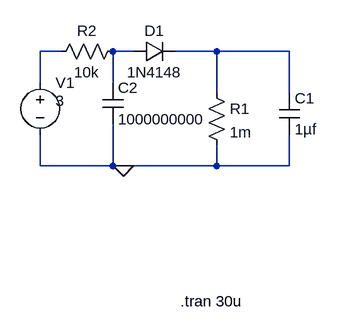
[diagram p0: schematic Draft3.asc]
Draft3.asc, the LTspice schematic file:
Version 4.1
SHEET 1 880 680
WIRE 64 64 32 64
WIRE 176 64 144 64
WIRE 304 64 240 64
WIRE 416 64 304 64
WIRE 32 112 32 64
WIRE 144 112 144 64
WIRE 304 128 304 64
WIRE 416 128 416 64
WIRE 32 240 32 192
WIRE 144 240 144 176
WIRE 144 240 32 240
WIRE 160 240 144 240
WIRE 304 240 304 208
WIRE 304 240 160 240
WIRE 416 240 416 192
WIRE 416 240 304 240
FLAG 160 240 0
SYMBOL voltage 32 96 R0
WINDOW 3 24 44 Left 2
WINDOW 123 0 0 Left 0
WINDOW 39 0 0 Left 0
SYMATTR InstName V1
SYMATTR Value 3
SYMBOL diode 176 80 R270
WINDOW 0 32 32 VTop 2
WINDOW 3 0 32 VBottom 2
SYMATTR InstName D1
SYMATTR Value 1N4148
SYMBOL res 288 112 R0
SYMATTR InstName R1
SYMATTR Value 1m
SYMBOL cap 400 128 R0
SYMATTR InstName C1
SYMATTR Value 1µf
SYMBOL res 160 48 R90
WINDOW 0 0 56 VBottom 2
WINDOW 3 32 56 VTop 2
SYMATTR InstName R2
SYMATTR Value 10k
SYMBOL cap 128 112 R0
SYMATTR InstName C2
SYMATTR Value 1000000000
TEXT 248 448 Left 2 !.tran 30u

The netlist it stands for:
* Draft3.asc
V1 N001 0 3
D1 N002 N003 1N4148
R1 N003 0 1m
C1 N003 0 1µf
R2 N002 N001 10k
C2 N002 0 1000000000
.model D D
.lib standard.dio
.tran 30u
.backanno
.end